# Altium schematic sheet Connectors.SchDoc
size A4; SheetNumber: 4; SheetTotal: 8
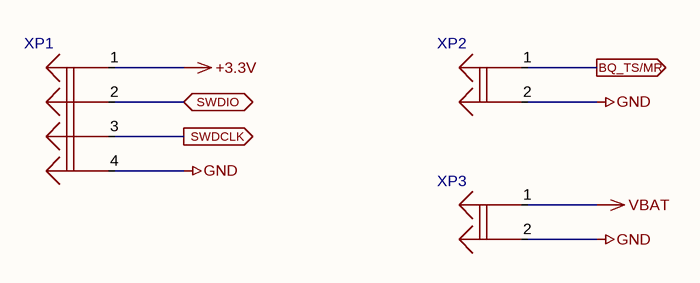
[diagram p0: Connectors.SchDoc]

## Parts
XP1  MOLEX 781710004  [MOLEX 781710004]  (value not drawn)
XP2  MOLEX 781710002  [MOLEX 781710002]  (value not drawn)
XP3  MOLEX 781710002  [MOLEX 781710002]  (value not drawn)

## Ports
BQ_TS/MR (out), SWDCLK (out), SWDIO (bidir)

## Nets
+3.3V: XP1.1
GND: XP1.4 XP2.2 XP3.2
VBAT: XP3.1
BQ_TS/MR: XP2.1 ; port BQ_TS/MR
SWDCLK: XP1.3 ; port SWDCLK
SWDIO: XP1.2 ; port SWDIO

## Library data of the parts
XP1 = MOLEX 781710004: 1.20mm Pitch, Pico-EZmate PCB Header, Single Row, Gold Plating, Friction Lock, 4 Circuits
XP2 XP3 = MOLEX 781710002: 1.20mm Pitch, Pico-EZmate PCB Header, Single Row, Gold Plating, Friction Lock, 2 Circuits